# Altium schematic sheet Microcontroller.SchDoc
size A; SheetNumber: 2; SheetTotal: 4
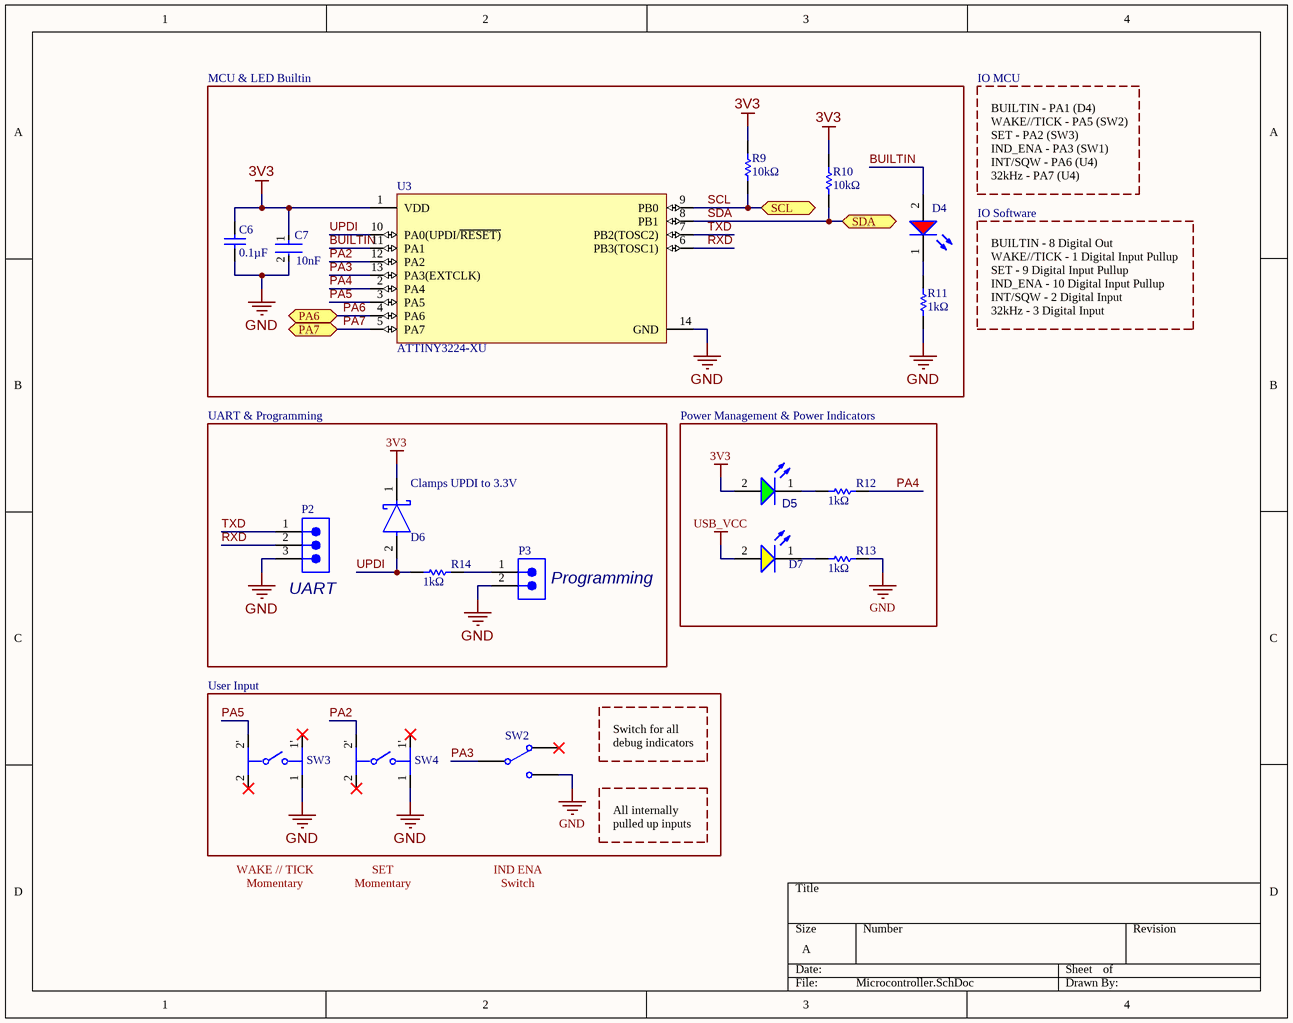
[diagram p0: Microcontroller.SchDoc]

## Parts
C6  0.1µF  [CAPC3216X100X50LL20T25]
C7  10nF  [FP-C1206C-EB-MFG]
D4  150120RS75000  [WL-SMCW_1206_150120xx75000]  (value not drawn)
D5  150120GS75000  [WL-SMCW_1206_150120xx75000]  (value not drawn)
D6  SS14-E3/61T  [FP-95400-MFG]  (value not drawn)
D7  150120YS75000  [WL-SMCW_1206_150120xx75000]  (value not drawn)
P2  61300311121  [61300311121]  (value not drawn)
P3  61300211121  [61300211121]  (value not drawn)
R9  10kΩ  [RESC3116X65X40LL10T20]
R10  10kΩ  [RESC3116X65X40LL10T20]
R11  1kΩ  [RESC3116X65X40LL10T20]
R12  1kΩ  [RESC3116X65X40LL10T20]
R13  1kΩ  [RESC3116X65X40LL10T20]
R14  1kΩ  [RESC3116X65X40LL10T20]
SW2  450404015514  [450404015514]  (value not drawn)
SW3  EVQ-9P701P  [FP-EVQ-9P701P-MFG]  (value not drawn)
SW4  EVQ-9P701P  [FP-EVQ-9P701P-MFG]  (value not drawn)
U3  ATTINY3224-XU  [FP-C04-087-ST-MFG]

## Blocks framed on the sheet
MCU & LED Builtin: C6 C7 D4 R9-R11 U3
Power Management & Power Indicators: D5 D7 R12 R13
User Input: SW2-SW4

## Ports
PA6 (bidir, see RTC IC[3B]), PA7 (bidir, see RTC IC[3B]), SCL (bidir, see Display[2B], RTC IC[2B]), SDA (bidir, see Display[2B], RTC IC[2B])

## Nets
3V3: C6.2 C7.1 D5.2(A) D6.1(C) R9.2 R10.2 U3.1(VDD)
GND: C6.1 C7.2 P2.3 P3.2 R11.1 R13.2 SW2.L2 SW3.1 SW4.1 U3.14(GND)
USB_VCC: D7.2(A)
BUILTIN: D4.2(A) U3.11(PA1)
PA2: SW4.2' U3.12(PA2)
PA3: SW2.COM U3.13(PA3(EXTCLK))
PA4: R12.2 U3.2(PA4)
PA5: SW3.2' U3.3(PA5)
PA6: U3.4(PA6) ; port PA6
PA7: U3.5(PA7) ; port PA7
RXD: P2.2 U3.6(PB3(TOSC1))
SCL: R9.1 U3.9(PB0) ; port SCL
SDA: R10.1 U3.8(PB1) ; port SDA
TXD: P2.1 U3.7(PB2(TOSC2))
UPDI: D6.2(A) R14.1 U3.10(PA0(UPDI/~{RESET)})
NetD4_1: D4.1(K) R11.2
NetD5_1: D5.1(K) R12.1
NetD7_1: D7.1(K) R13.1
NetP3_1: P3.1 R14.2

Not connected (* = marked no-connect by the designer): SW2 L1*; SW3 1'* 2*; SW4 1'* 2*

## Notes on the sheet
- IO MCU
- BUILTIN - PA1 (D4)
- WAKE//TICK - PA5 (SW2)
- SET - PA2 (SW3)
- IND_ENA - PA3 (SW1)
- INT/SQW - PA6 (U4)
- IO Software
- 32kHz - PA7 (U4)
- BUILTIN - 8 Digital Out
- WAKE//TICK - 1 Digital Input Pullup
- SET - 9 Digital Input Pullup
- IND_ENA - 10 Digital Input Pullup
- INT/SQW - 2 Digital Input
- 32kHz - 3 Digital Input
- UART & Programming
- (near D6) Clamps UPDI to 3.3V
- (near P2) UART
- (near P3) Programming
- Switch for all debug indicators
- All internally pulled up inputs
- WAKE // TICK
- Momentary
- SET
- IND ENA
- Switch

## Library data of the parts
C6 = CMP-1664-00001-4: Chip Capacitor, 100 nF, +/- 10%, 25 V, -55 to 125 degC, 1206 (3216 Metric), RoHS, Tape and Reel; Manufacturer: Kemet; Voltage Rating: 25 V; ComponentLink1URL: http://www.kemet.com/; Max Operating Temperature: 125 degC; PackageReference: 1206; ComponentLink2URL: http://www.kemet.com/docfinder?Partnumber=C1206F104K3RACTU; ComponentLink1Description: Manufacturer URL; ComponentLink2Description: Datasheet; Length: 3.2 mm; Packaging: Tape and Reel; Height: 0.78 mm; Mounting Technology: Surface Mount; REACH SVHC: No SVHC; PackageDescription: 2-Pin Surface Mount Device, Body 3.2 x 1.6 mm; Min Operating Temperature: -55 degC; RoHSCompliant: true; DatasheetVersion: 02/2016; Package Quantity: 4000
C7 = CMP-03020-003656-1: CAP CER 10000PF 100V X7R 1206; Manufacturer: KEMET; Manufacturer Part Number: C1206C103J1RACTU; Temperature Coefficient: 15%; Capacitance: 10,000 pF; Automotive Grade: Grade 0; Value: 10,000 pF; Material: Ceramic; Tolerance: 0.05; Digikey Description: CAP CER 10000PF 100V X7R 1206; Temperature Range Low: -55°C; Height: 0.88mm; Automotive: Yes; Ipc Land Pattern Name: CAPC320160X78; ComponentLink2URL: https://content.kemet.com/datasheets/KEM_C1007_X8R_ULTRA_150C_SMD.pdf; Device Class L2: Capacitors; Mouser Description: 1206 C 10nF Ceramic Multilayer Capacitor, 100 VDC, +125degC, X7R Dielec, +/-5%; Octopart: https://octopart.com/c1206c103j1ractu-kemet-121270; Category: Cap; Temperature Characteristic: X7R; Voltage Rating: 100 V; Temperature: -55°C to +150°C; Device Class L1: Passive Components; RoHS: TRUE; Device Class L3: Ceramic Capacitors; Package: C1206C-EB; Lead Free: Yes; ComponentLink2Description: Datasheet; Temperature Range High: +150°C
D4 = CMP-1426-00013-4: WL-SMCW SMT Mono-Color Chip LED Waterclear; Luminous Intensity: 150mcd; Max Junction Temperature (Tj): 95°C; Lens Style: Clear, Rectangular; Color: Red; Wavelength: 625nm; Forward Current: 100mA; Test Current: 20mA; Power Dissipation: 72mW; Forward Voltage: 2V; Peak Wavelength: 630nm; Reverse Voltage: 5V; Viewing Angle: 140°; Length: 3.2mm; Case Code (Imperial): 1206; Mount: Surface Mount; Case/Package: 1206; Packaging: Tape and Reel; REACH SVHC: Unknown; Max Operating Temperature: 85°C; RoHS: Compliant; Height: 680µm; Dominant Wavelength: 625nm; Width: 1.6mm; Max Reverse Voltage (DC): 5V; Case Code (Metric): 3216; Min Operating Temperature: -40°C
D5 = CMP-1426-00014-4: WL-SMCW SMT Mono-Color Chip LED Waterclear; Dominant Wavelength: 525nm; Reverse Voltage: 5V; Max Junction Temperature (Tj): 95°C; Lens Style: Clear, Rectangular; Forward Voltage: 3.2V; Power Dissipation: 105mW; Peak Wavelength: 515nm; Test Current: 20mA; Color: Green; Forward Current: 100mA; Luminous Intensity: 450mcd; Viewing Angle: 140°; Case Code (Imperial): 1206; REACH SVHC: Unknown; Packaging: Tape and Reel; Max Operating Temperature: 85°C; Case/Package: 1206; Height: 680µm; Length: 3.2mm; Mount: Surface Mount; Min Operating Temperature: -40°C; Width: 1.6mm; Case Code (Metric): 3216; Max Reverse Voltage (DC): 5V; RoHS: Compliant; Wavelength: 525nm
D6 = CMP-02539-000035-1: DIODE SCHOTTKY 40V 1A DO214AC; Manufacturer: Vishay; Peak Reverse Current: 0.2mA; Standoff Height: 0mm; Max Junction Temp: +150°C; Max Surge Forward Current: 40A; RoHS: TRUE; Digikey Description: DIODE SCHOTTKY 40V 1A DO214AC; Category: Diode; Device Class L3: Schottky Diodes; Temperature Range High: +150°C; Automotive: No; Temperature: -65°C to +150°C; Device Class L2: Diodes; Forward Current: 1A; Temperature Range Low: -65°C; Footprint Url: http://www.vishay.com/docs/95400/sma.pdf; Octopart: https://octopart.com/ss14-e3%2F61t-vishay-39552847; Package: 95400; Max Repetitive Reverse Voltage: 40V; ComponentLink2Description: Datasheet; ComponentLink2URL: http://www.vishay.com/docs/88746/ss12.pdf; Lead Free: Yes; Height: 2.29mm; Mouser Description: SS14 Series 40 V 1 A Surface Mount Schottky Barrier Rectifier - DO-214AC (SMA); Manufacturer Part Number: SS14-E3/61T; Device Class L1: Discrete Semiconductors
D7 = CMP-1426-00019-3: Led, Yellow, 590 Nm, 2 V, 30 Ma, 120 Mcd Rohs Compliant: Yes; Dominant Wavelength: 590nm; Forward Voltage: 2V; Forward Current: 100mA; Viewing Angle: 140°; Max Reverse Voltage (DC): 5V; Peak Wavelength: 595nm; Lens Style: Clear, Rectangular; Test Current: 20mA; Luminous Intensity: 120mcd; REACH SVHC: Unknown; Length: 3.2mm; RoHS: Compliant; Packaging: Tape and Reel; Min Operating Temperature: -40°C; Mount: Surface Mount; Max Operating Temperature: 85°C; Wavelength: 590nm; Case/Package: 1206; Case Code (Imperial): 1206; Color: Yellow; Height: 680µm; Case Code (Metric): 3216; Width: 1.6mm
P2 = CMP-1502-01062-3: NexarPartId: 32855521; Current Rating: 3A; Voltage Rating: 250V; Number of Positions: 3; Pitch: 2.54mm; Contact Resistance: 20mΩ; Connector Type: Male Pin; Gender: Male; REACH SVHC: Unknown; Packaging: Bulk; Contact Material: Copper; Min Operating Temperature: -40°C; Number of Rows: 1; Orientation: Vertical; RoHS: Compliant; Contact Plating: Gold; Max Operating Temperature: 105°C; Mount: Through Hole; Height: 8.94mm; Operating Supply Voltage: 250V; Number of Pins: 3; Contact Mating Length: 5.9944mm; Number of Contacts: 3; Color: Black; Lead Free: Lead Free; Lead Pitch: 2.54mm; Termination: Solder
P3 = CMP-1712-00002-6: NexarPartId: 20081794; Number of Contacts: 2; Pitch: 2.54mm; Connector Type: Male Pin; Voltage Rating: 250V; Current Rating: 3A; Gender: Male; Contact Resistance: 20mΩ; Height: 8.94mm; Lead Free: Lead Free; Number of Pins: 2; Termination: Through Hole; RoHS: Compliant; Lead Pitch: 2.54mm; REACH SVHC: No SVHC; Housing Material: PBT; Contact Mating Length: 5.9944mm; Min Operating Temperature: -40°C; Orientation: Vertical; Contact Material: Copper; Contact Gender: Male; Max Operating Temperature: 125°C; Number of Rows: 1; Number of Positions: 2; Packaging: Bulk; Contact Plating: Gold; Mount: Through Hole; Color: Black; Operating Supply Voltage: 250V
R9 R10 = CMP-1014-00623-2: Chip Resistor, 10 KOhm, +/- 1%, 0.25 W, -55 to 155 degC, 1206 (3216 Metric), RoHS, Tape and Reel; Manufacturer: Yageo; Voltage Rating: 200V; Resistance: 10KOhm; Temperature Coefficient: 100ppm/degreesC; Power Rating: 250mW; Packaging: TapeandReel; Termination: SMD/SMT; REACH SVHC: Unknown; Tolerance: 1%; Height: 0.55mm; Composition: ThickFilm; Max Operating Temperature: 155degC; Datasheet Version: Rev. 5, 10/2016; Lead Free: LeadFree; Case Code (Metric): 3216; Depth: 1.6mm; Package Quantity: 5000; RoHSCompliant: true; Military Standard: Not; Case/Package: 1206; Case Code (Imperial): 1206; Min Operating Temperature: -55degC; Datasheet URL: http://www.yageo.com/NewPortal/yageodocoutput?fileName=/pdf/R-Chip/PYu-RC_Group_51_RoHS_L_5.pdf; Length: 3.1mm; Manufacturer URL: http://www.yageo.com/; Package Reference: 1206.0; Width: 1.6mm; Package Description: 2-Pin Surface Mount Device, Body 3.1 x 1.6 mm
R11-R14 = CMP-2100-03678-1: Chip Resistor, 1 KOhm, +/- 1%, 0.25 W, -55 to 155 degC, 1206 (3216 Metric), RoHS, Tape and Reel; Manufacturer: Yageo; Temperature Coefficient: 100ppm/degreesC; Power Rating: 250mW; Voltage Rating: 200V; Resistance: 1KOhm; Composition: ThickFilm; Min Operating Temperature: -55degC; Tolerance: 1%; REACH SVHC: Unknown; Case Code (Metric): 3216; Military Standard: Not; Datasheet Version: Rev. 5, 10/2016; Package Reference: 1206.0; Case/Package: 1206; Length: 3.1mm; Manufacturer URL: http://www.yageo.com/; Lead Free: LeadFree; RoHSCompliant: true; Termination: SMD/SMT; Packaging: TapeandReel; Package Description: 2-Pin Surface Mount Device, Body 3.1 x 1.6 mm; Depth: 1.6mm; Case Code (Imperial): 1206; Max Operating Temperature: 155degC; Datasheet URL: http://www.yageo.com/NewPortal/yageodocoutput?fileName=/pdf/R-Chip/PYu-RC_Group_51_RoHS_L_5.pdf; Height: 0.55mm
SW2 = CMP-03913-99472344-1: 450404015514 Slide Switch, 0.3A, 5Vdc, Smd Rohs Compliant: Yes; Current Rating: 300mA; Insulation Resistance: 100MΩ; Voltage Rating: 5V; NexarPartId: 99472344; Min Operating Temperature: -40°C; Contact Plating: Silver; Packaging: Tape and Reel; Max Operating Temperature: 85°C; RoHS: Compliant
SW3 SW4 = CMP-05618-000010-1: SWITCH TACTILE SPST-NO 0.05A 12V; Manufacturer: Panasonic; Contact Resistance: 500mΩ; Contact Current Rating: 50mA; Operating Force: 1.6N; Electromechanical Life: 100000Cycles; Height: 1.55mm; RoHS: TRUE; Digikey Description: SWITCH TACTILE SPST-NO 0.05A 12V; Automotive: No; Device Class L2: Switches; ComponentLink2URL: https://www3.panasonic.biz/ac/e_download/control/switch/light-touch/catalog/sw_lt_eng_3529s_side.pdf?f_cd=402906&via=ok; Lead Free: Yes; Device Class L3: Tactile Switches; Manufacturer Part Number: EVQ-9P701P; Device Class L1: Electromechanical; Category: Switch; Package: EVQ-9P701P; Mouser Description: Tactile Switches SMD 3.5X2.9MM SID-OP L SHAPED TERM 1.6N; Throw Configuration: SPST-NO; Octopart: https://octopart.com/evq-9p701p-panasonic-58006746; Voltage Rating Dc: 12V; Temperature Range Low: -20°C; ComponentLink2Description: Datasheet; Temperature: -20°C to +70°C; Temperature Range High: +70°C
U3 = CMP-00252-122240563-1: ATTINY3224-XU Microcontroller 8-Bit AVR RISC 32KB Flash 1.8V to 5.5V 14-Pin TSSOP Tube; NexarPartId: 122240563